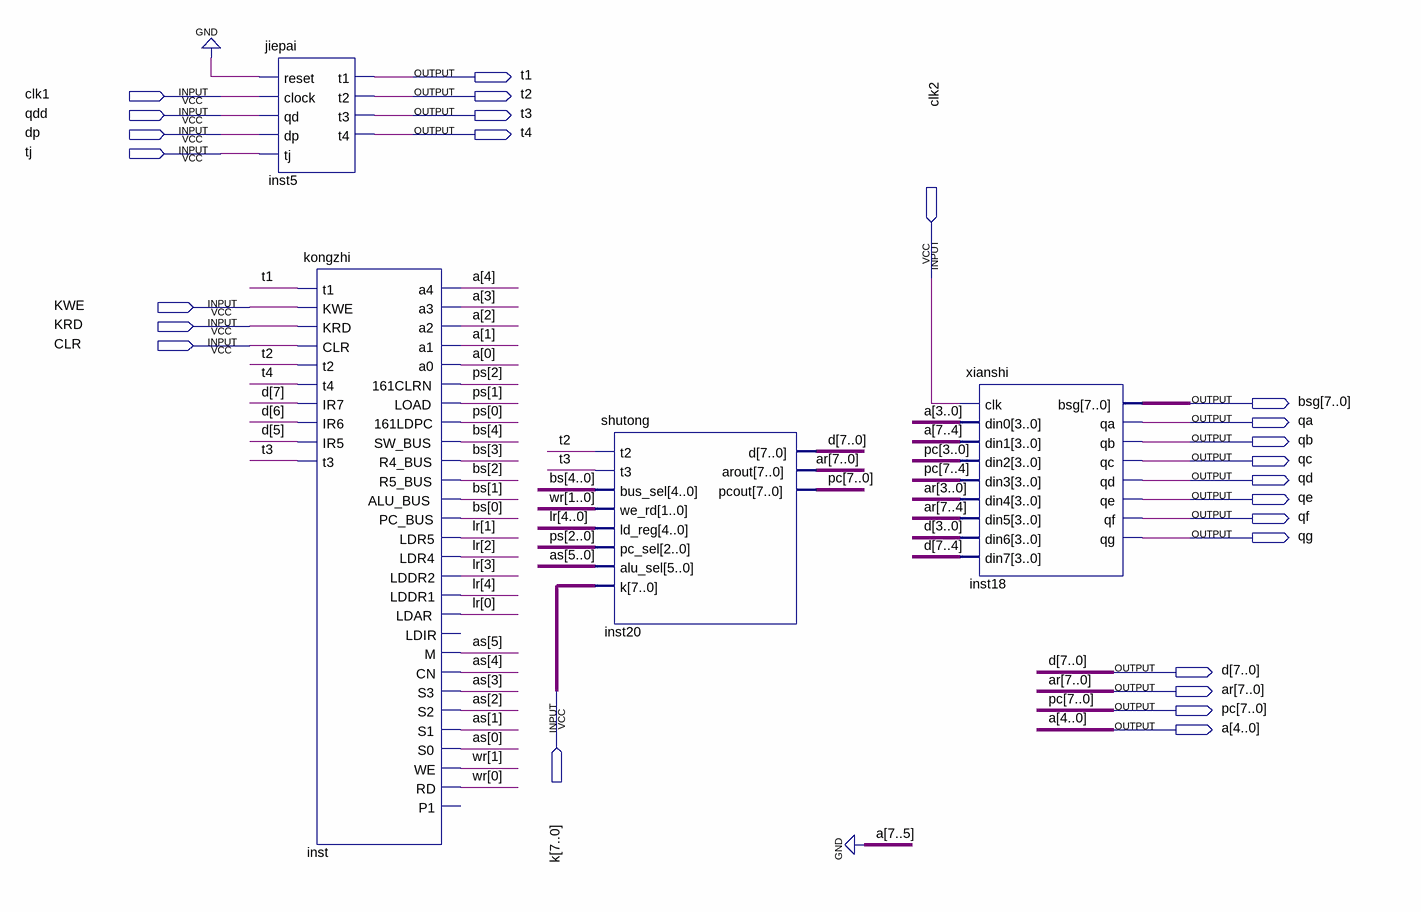
[diagram p0: schematic sheet]
// Quartus schematic microcomputer.bdf as structural Verilog: 4 symbols, 25 pins
module microcomputer (
  input  clk1,
  input  qdd,
  input  dp,
  input  tj,
  input  clk2,
  input  KWE,
  input  KRD,
  input  CLR,
  input  [7:0] k,
  output t1,
  output t2,
  output t3,
  output t4,
  output [7:0] bsg,
  output qa,
  output qb,
  output qc,
  output qd,
  output qe,
  output qf,
  output qg,
  output [7:0] d,
  output [7:0] ar,
  output [7:0] pc,
  output [4:0] a
);

  wire [1:0] wr;
  wire [2:0] ps;
  wire [4:0] bs, lr;
  wire [5:0] as;

  jiepai inst5 (.reset(1'b0), .clock(clk1), .qd(qdd), .dp(dp), .tj(tj), .t1(t1), .t2(t2), .t3(t3), .t4(t4));
  kongzhi inst (
    .t1(t1), .KWE(KWE), .KRD(KRD), .CLR(CLR), .t2(t2), .t4(t4), .IR7(d[7]), .IR6(d[6]), .IR5(d[5]), .t3(t3),
    .a4(a[4]), .a3(a[3]), .a2(a[2]), .a1(a[1]), .a0(a[0]), .\161CLRN (ps[2]), .LOAD(ps[1]),
    .\161LDPC (ps[0]), .SW_BUS(bs[4]), .R4_BUS(bs[3]), .R5_BUS(bs[2]), .ALU_BUS(bs[1]), .PC_BUS(bs[0]),
    .LDR5(lr[1]), .LDR4(lr[2]), .LDDR2(lr[3]), .LDDR1(lr[4]), .LDAR(lr[0]), .M(as[5]), .CN(as[4]),
    .S3(as[3]), .S2(as[2]), .S1(as[1]), .S0(as[0]), .WE(wr[1]), .RD(wr[0]));  // open: LDIR, P1
  shutong inst20 (
    .t2(t2), .t3(t3), .bus_sel(bs), .we_rd(wr), .ld_reg(lr), .pc_sel(ps), .alu_sel(as), .k(k), .arout(ar),
    .pcout(pc), .d(d));
  xianshi inst18 (
    .clk(clk2), .din0(a[3:0]), .din1({3'b000, a[4]}), .din2(pc[3:0]), .din3(pc[7:4]), .din4(ar[3:0]),
    .din5(ar[7:4]), .din6(d[3:0]), .din7(d[7:4]), .bsg(bsg), .qa(qa), .qb(qb), .qc(qc), .qd(qd), .qe(qe),
    .qf(qf), .qg(qg));
endmodule
